# EAGLE design stuffMonitor (EAGLE 8.3.2)
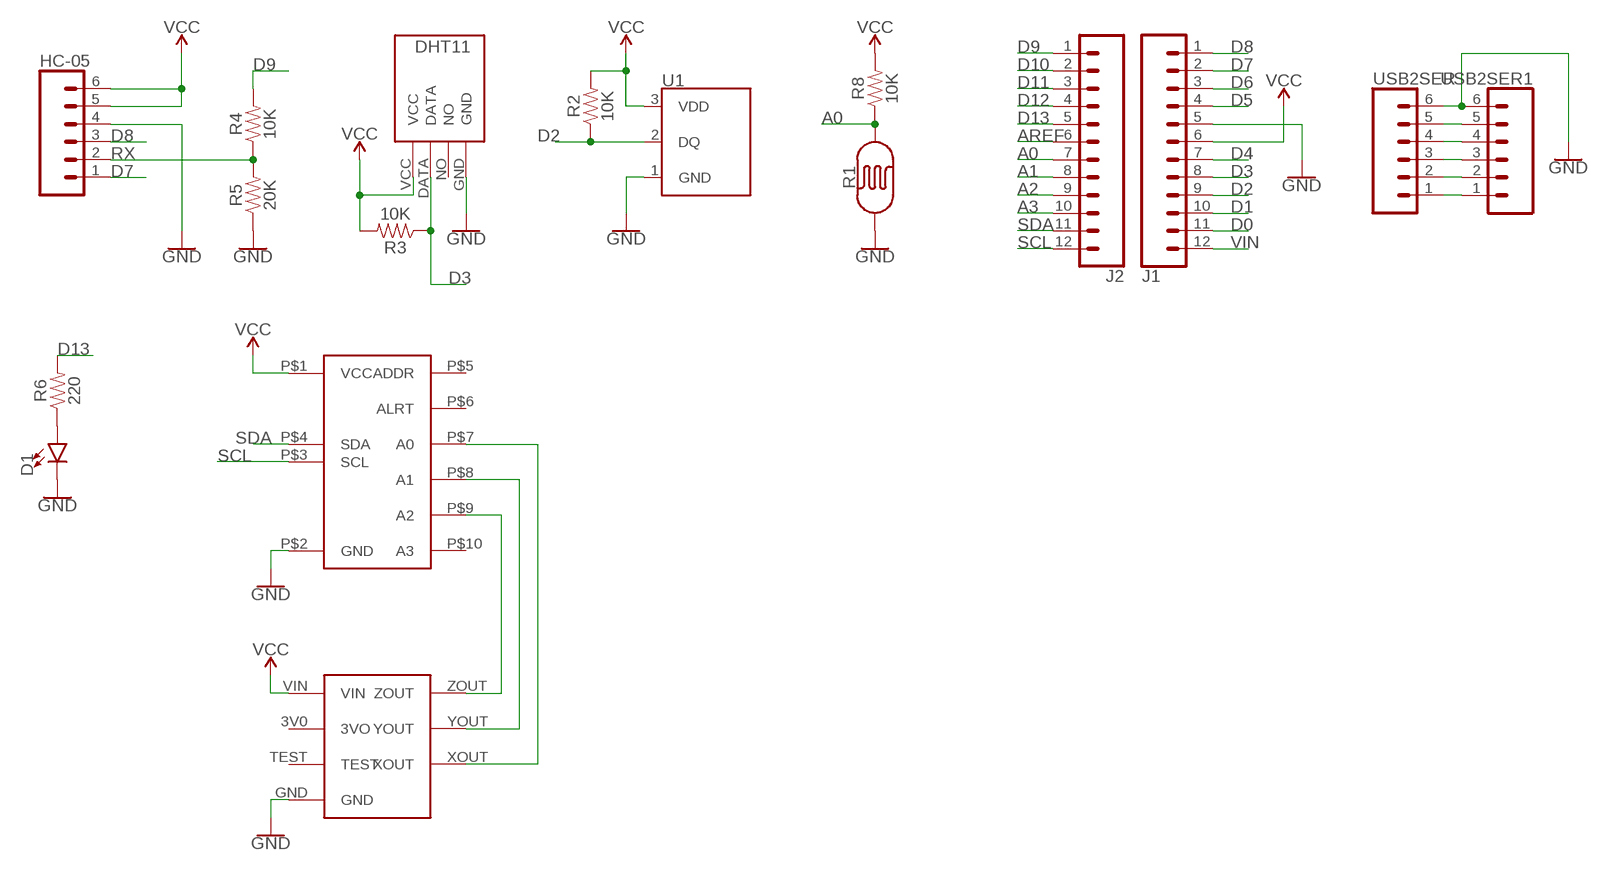
[diagram p0: schematic, sheet 1]

## Parts
D1  LED5MM  [LED_5MM]
HC-05  CONN_06NO_SILK_FEMALE_PTH  [1X06_NO_SILK]
J1  CONN_12  [1X12]
J2  CONN_12  [1X12]
R1  PHOTOCELLPTH  [PHOTOCELL]
R2  10K  1KOHM-VERT-1/4W-5%  [AXIAL-0.1]
R3  10K  1KOHM-VERT-1/4W-5%  [AXIAL-0.1]
R4  10K  1KOHM-VERT-1/4W-5%  [AXIAL-0.1]
R5  20K  1KOHM-VERT-1/4W-5%  [AXIAL-0.1]
R6  220  1KOHM-VERT-1/4W-5%  [AXIAL-0.1]
R8  10K  1KOHM-VERT-1/4W-5%  [AXIAL-0.1]
U1  DS18B20  [TO-92-AMMO]
U$2  SCRAPACCEL  [SCRAPACCELANALOG]
U$3  12BITADCADAFRUIT  [ADC12BITADAFRUIT]
U$4  DHT11-PION.  [DHT11-PION.]
USB2SER  CONN_06NO_SILK_FEMALE_PTH  [1X06_NO_SILK]
USB2SER1  CONN_06NO_SILK_FEMALE_PTH  [1X06_NO_SILK]

## Nets
A0: J2.7 R1.2 R8.P$1
A1: J2.8
A2: J2.9
A3: J2.10
AREF: J2.6
D0: J1.11
D1: J1.10
D2: J1.9 R2.P$1 U1.2(DQ)
D3: J1.8 R3.P$1 U$4.DATA
D4: J1.7
D5: J1.4
D6: J1.3
D7: HC-05.1 J1.2
D8: HC-05.3 J1.1
D9: J2.1 R4.P$2
D10: J2.2
D11: J2.3
D12: J2.4
D13: J2.5 R6.P$2
GND: D1.K(C) HC-05.4 J1.5 R1.1 R5.P$1 U1.1(GND) U$2.GND U$3.P$2(GND) U$4.GND USB2SER1.6 USB2SER.6
N$1: D1.A R6.P$1
N$2: USB2SER1.1 USB2SER.1
N$3: USB2SER1.2 USB2SER.2
N$4: USB2SER1.3 USB2SER.3
N$5: USB2SER1.4 USB2SER.4
N$6: USB2SER1.5 USB2SER.5
N$7: U$2.ZOUT U$3.P$9(A2)
N$8: U$2.YOUT U$3.P$8(A1)
N$9: U$2.XOUT U$3.P$7(A0)
RX: HC-05.2 R4.P$1 R5.P$2
SCL: J2.12 U$3.P$3(SCL)
SDA: J2.11 U$3.P$4(SDA)
VCC: HC-05.5 HC-05.6 J1.6 R2.P$2 R3.P$2 R8.P$2 U1.3(VDD) U$2.VIN U$3.P$1(VCC) U$4.VCC
VIN: J1.12
Unconnected: U$2.3V0(3VO) U$2.TEST U$3.P$5(ADDR) U$3.P$6(ALRT) U$3.P$10(A3) U$4.NO

## Library data of the parts
D1 = SparkFun-LED:LED: LED (Generic) Standard schematic elements and footprints for 5mm, 3mm, 1206, and 0603 sized LEDs. Generic LEDs with no color specified.
HC-05 USB2SER USB2SER1 = SparkFun-Connectors:CONN_06: Multi connection point. Often used as Generic Header-pin footprint for 0.1 inch spaced/style header connections On any of the 0.1 inch spaced packages, you can populate with these: Break Away Headers - Straight <https://www.sparkfun.com/products/116> (PRT-00116) Break Away Male Headers - Right Angle <https://www.sparkfun.com/products/553> (PRT-00553) Female Headers <https://www.sparkfun.com/products/115> (PRT-00115) Break Away Headers - Machine Pin <https://www.sparkfun.com/products/117> (PRT-00117) Break Away Female Headers - Swiss Machine Pin <https://www.sparkfun.com/products/743> (PRT-00743) Arduino Stackable Header - 6 Pin <https://www.sparkfun.com/products/9280> (PRT-09280) For SCREWTERMINALS and SPRING TERMINALS visit here: Screw Terimnals on SparkFun.com <https://www.sparkfun.com/search/results?term=Screw+Terminals> (5mm/3.5mm/2.54mm spacing) This device is also useful as a general connection point to wire up your design to another part of your project. Our various solder wires solder well into these plated through hole pads. Hook-Up Wire - Assortment (Stranded, 22 AWG) <https://www.sparkfun.com/products/11375> (PRT-11375) Hook-Up Wire - Assortment (Solid Core, 22 AWG) <https://www.sparkfun.com/products/11367> (PRT-11367) View the entire wire category on our website here <https://www.sparkfun.com/categories/141>; PROD_ID: CONN-08437
J1 J2 = SparkFun-Connectors:CONN_12: Multi connection point. Often used as Generic Header-pin footprint for 0.1 inch spaced/style header connections On any of the 0.1 inch spaced packages, you can populate with these: Break Away Headers - Straight <https://www.sparkfun.com/products/116> (PRT-00116) Break Away Male Headers - Right Angle <https://www.sparkfun.com/products/553> (PRT-00553) Female Headers <https://www.sparkfun.com/products/115> (PRT-00115) Break Away Headers - Machine Pin <https://www.sparkfun.com/products/117> (PRT-00117) Break Away Female Headers - Swiss Machine Pin <https://www.sparkfun.com/products/743> (PRT-00743) For SCREWTERMINALS and SPRING TERMINALS visit here: Screw Terimnals on SparkFun.com <https://www.sparkfun.com/search/results?term=Screw+Terminals> (5mm/3.5mm/2.54mm spacing) This device is also useful as a general connection point to wire up your design to another part of your project. Our various solder wires solder well into these plated through hole pads. Hook-Up Wire - Assortment (Stranded, 22 AWG) <https://www.sparkfun.com/products/11375> (PRT-11375) Hook-Up Wire - Assortment (Solid Core, 22 AWG) <https://www.sparkfun.com/products/11367> (PRT-11367) View the entire wire category on our website here <https://www.sparkfun.com/categories/141> Special notes: Molex polarized connector foot print use with SKU : PRT-08231 with associated crimp pins and housings. 1MM SMD Version SKU: PRT-10208 NOTES ON THE VARIANTS LOCK and LOCK_LONGPADS... This footprint was designed to help hold the alignment of a through-hole component (i.e. 6-pin header) while soldering it into place. You may notice that each hole has been shifted either up or down by 0.005 of an inch from it's more standard position (which is a perfectly straight line). This slight alteration caused the pins (the squares in the middle) to touch the edges of the holes. Because they are alternating, it causes a "brace" to hold the component in place. 0.005 has proven to be the perfect amount of "off-center" position when using our standard breakaway headers. Although looks a little odd when you look at the bare footprint, once you have a header in there, the alteration is very hard to notice. Also,if you push a header all the way into place, it is covered up entirely on the bottom side.
R1 = SparkFun-Sensors:PHOTOCELL: Photocell (Photodetector, Photo Resistor, CdS) This is a very small light sensor. A photocell changes (also called a photodetector, photo resistor, CdS or photoconductive cell) resistance depending on the amount of light it is exposed to. These little sensors make great ambient light triggers (when light in the room turns on, do something). Datasheet <http://cdn.sparkfun.com/datasheets/Sensors/LightImaging/SEN-09088.pdf> SparkFun Products Mini Photocell <https://www.sparkfun.com/products/9088> (SEN-09088); PROD_ID: COMP-09129; SF_ID: SEN-09088
R2-R6 R8 = SparkFun-Resistors:1KOHM: 1kΩ resistor A resistor is a passive two-terminal electrical component that implements electrical resistance as a circuit element. Resistors act to reduce current flow, and, at the same time, act to lower voltage levels within circuits. - Wikipedia; PROD_ID: RES-08380; VALUE: 1k
U1 = SparkFun-Sensors:DS18B20: Dallas/Maxim DS18B20 1-Wire Temperature Sensor The DS18B20 reports degrees C with 9 to 12-bit precision, -55C to 125C (+/-0.5C). Each sensor has a unique 64-Bit Serial number etched into it - allows for a huge number of sensors to be used on one data bus. Datasheet <http://datasheets.maximintegrated.com/en/ds/DS18B20.pdf> SparkFun Products One Wire Digital Temperature Sensor - DS18B20 <https://www.sparkfun.com/products/245> (SEN-00245); STORE_ID: SEN-00245
U$2 = scrapAccel:SCRAPACCEL
U$3 = 12bitadcadafruit:12BITADCADAFRUIT
U$4 = DHT11:DHT11-PION.: DHT11 Czujnik temperatury i wilgotności (widok pionowy)

## Board
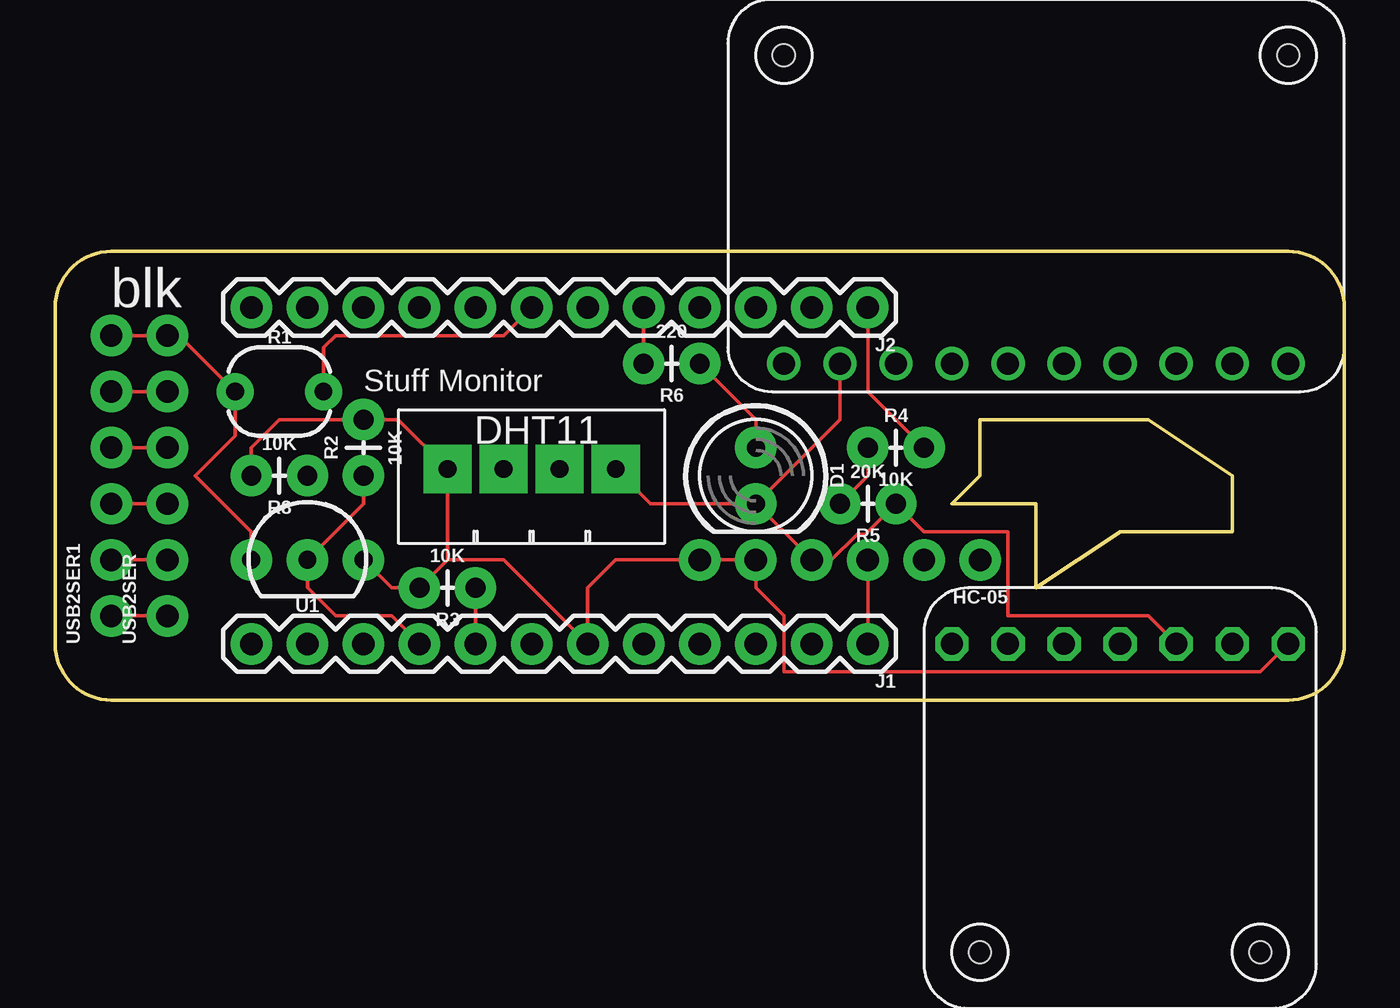
[diagram p1: board, top side]
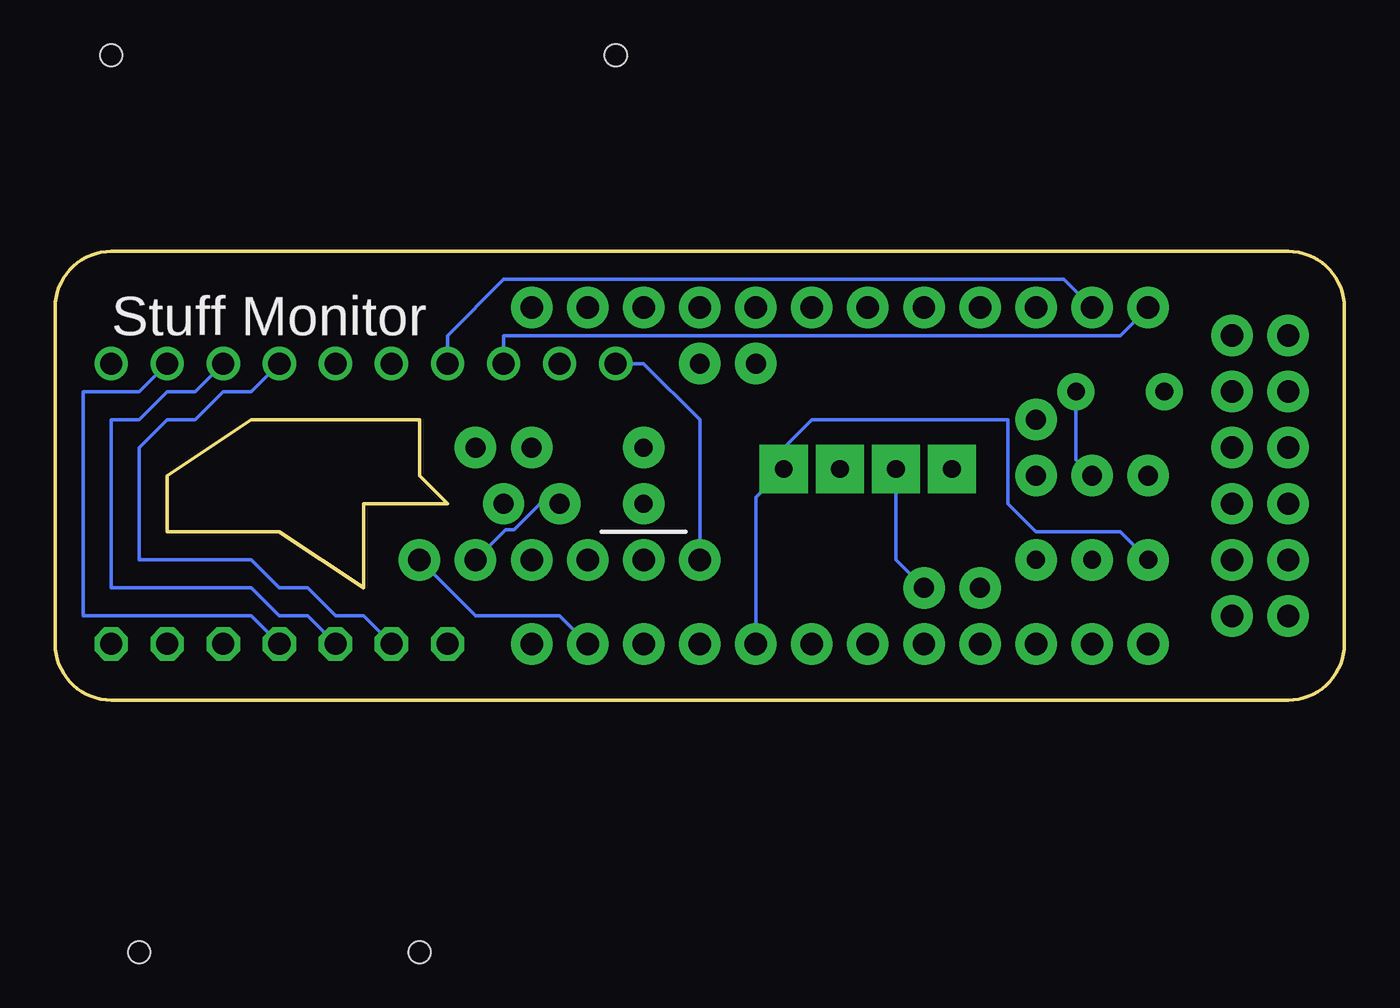
[diagram p2: board, bottom side, seen from below]

Size 58.42 x 20.32 mm. Coordinates in mm from the lower left corner, seen from the top.
Outline: 0,17.78 arc-90 2.54,20.32 55.88,20.32 arc-90 58.42,17.78 58.42,2.54 arc-90 55.88,0 2.54,0 arc-90 0,2.54 0,17.78
Outline: 44.45,8.89 40.64,8.89 41.91,10.16 41.91,12.7 49.53,12.7 53.34,10.16 53.34,7.62 48.26,7.62 44.45,5.08 44.45,8.89
Copper layers (1*16): Top 0.035mm / dielectric 1.5mm / Bottom 0.035mm
Design rules "default": minimum track width 6mil, minimum drill 0.35mm, track to track 6mil, track to pad 6mil, pad to pad 6mil, via to via 6mil, smd to smd 6mil, copper to edge 40mil, drill to drill 6mil, minimum pad ring 10mil, minimum via ring 8mil, stop-mask expansion 4mil, vias tented up to drill 0mil, thermal gap 10mil

### Footprints (pad centres in the part's own frame; a part is rotated, then mirrored left to right if it is on the bottom)
LED_5MM = drill 0.813 pad 1.88: A -1.27,0; K 1.27,0
1X06_NO_SILK = drill 1.016 pad 1.88: 1 0,0; 2 2.54,0; 3 5.08,0; 4 7.62,0; 5 10.16,0; 6 12.7,0
1X12 = drill 1.016 pad 1.88: 1 0,0; 2 2.54,0; 3 5.08,0; 4 7.62,0; 5 10.16,0; 6 12.7,0; 7 15.24,0; 8 17.78,0; 9 20.32,0; 10 22.86,0; 11 25.4,0; 12 27.94,0
PHOTOCELL = drill 0.8 pad 1.676: 1 -2,0; 2 2,0
AXIAL-0.1 = drill 0.9 pad 1.88: P$1 -1.27,0; P$2 1.27,0
TO-92-AMMO = drill 0.813 pad 1.88: 1 -2.54,0; 2 0,0; 3 2.54,0
SCRAPACCELANALOG = drill 1 octagon: 3V0 -5.08,-7.62; GND -2.54,-7.62; TEST 7.62,-7.62; VIN -7.62,-7.62; XOUT 5.08,-7.62; YOUT 2.54,-7.62; ZOUT 0,-7.62 | hole 1: -6.35,6.35; 6.35,6.35
ADC12BITADAFRUIT = drill 1: P$1 2.54,0; P$2 5.08,0; P$3 7.62,0; P$4 10.16,0; P$5 12.7,0; P$6 15.24,0; P$7 17.78,0; P$8 20.32,0; P$9 22.86,0; P$10 25.4,0 | hole 1: 2.54,13.97; 25.4,13.97
DHT11-PION. = drill 0.8 pad 2.184 square: DATA -1.27,0.305; GND 3.81,0.305; NO 1.27,0.305; VCC -3.81,0.305

### Placement (x,y rotation side)
D1  31.75,10.16 270 top
HC-05  41.91,6.35 180 top
J1  36.83,2.54 180 top
J2  36.83,17.78 180 top
R1  10.16,13.97 0 top
R2  13.97,11.43 90 top
R3  17.78,5.08 180 top
R4  38.1,11.43 0 top
R5  36.83,8.89 180 top
R6  27.94,15.24 180 top
R8  10.16,10.16 180 top
U1  11.43,6.35 0 top
U$2  48.26,-5.08 180 top
U$3  30.48,15.24 0 top
U$4  21.59,10.16 0 top
USB2SER  5.08,3.81 90 top
USB2SER1  2.54,3.81 90 top

### Tracks (layer width: path | path; a pad name or v marks a point on that pad's centre or on a via)
A0
  Top 0.152: R1.2 12.16,15.97 12.7,16.51 20.32,16.51 J2.7
  Bottom 0.152: R1.2 12.16,10.89 R8.P$1
D2
  Top 0.152: R2.P$1 13.97,8.89 U1.2 11.43,5.08 12.7,3.81 15.24,3.81 J1.9
D3
  Top 0.152: R3.P$1 J1.8
  Bottom 0.152: U$4.DATA 20.32,6.35 R3.P$1
D7
  Bottom 0.152: J1.2 35.56,3.81 39.37,3.81 HC-05.1
D8
  Top 0.152: HC-05.3 J1.1
D9
  Top 0.152: R4.P$2 36.83,13.97 J2.1
D13
  Top 0.152: R6.P$2 J2.5
GND
  Top 0.152: USB2SER1.6 USB2SER.6 5.62,16.51 R1.1 8.16,11.97 6.35,10.16 8.89,7.62 U1.1 | D1.K 26.97,8.89 U$4.GND | D1.K HC-05.4 35.18,6.35 36.35,7.52 36.73,7.52 R5.P$1 39.37,7.62 43.18,7.62 43.18,3.81 49.53,3.81 U$2.GND | U$3.P$2 35.56,12.7 D1.K
  Bottom 0.152: U1.1 10.16,7.62 13.97,7.62 15.24,8.89 15.24,12.7 24.13,12.7 25.4,11.43 U$4.GND 26.67,9.2 J1.5
N$1
  Top 0.152: D1.A 31.75,12.7 R6.P$1
N$2
  Top 0.152: USB2SER1.1 USB2SER.1
N$3
  Top 0.152: USB2SER1.2 USB2SER.2
N$4
  Top 0.152: USB2SER1.3 USB2SER.3
N$5
  Top 0.152: USB2SER1.4 USB2SER.4
N$6
  Top 0.152: USB2SER1.5 USB2SER.5
N$7
  Bottom 0.152: U$3.P$9 54.61,13.97 57.15,13.97 57.15,3.81 49.53,3.81 U$2.ZOUT
N$8
  Bottom 0.152: U$3.P$8 52.07,13.97 53.34,13.97 54.61,12.7 55.88,12.7 55.88,5.08 49.53,5.08 48.26,3.81 46.99,3.81 U$2.YOUT
N$9
  Bottom 0.152: U$3.P$7 49.53,13.97 50.8,13.97 52.07,12.7 53.34,12.7 54.61,11.43 54.61,6.35 49.53,6.35 48.26,5.08 46.99,5.08 45.72,3.81 44.45,3.81 U$2.XOUT
RX
  Top 0.152: R4.P$1 36.83,10.16 R5.P$2
  Bottom 0.152: HC-05.2 38,7.72 37.62,7.72 36.45,8.89 R5.P$2
SCL
  Bottom 0.152: U$3.P$3 38.1,16.51 10.16,16.51 J2.12
SDA
  Bottom 0.152: U$3.P$4 40.64,16.51 38.1,19.05 12.7,19.05 J2.11
VCC
  Top 0.152: R8.P$2 8.89,11.43 10.16,12.7 R2.P$2 15.55,12.7 U$4.VCC 17.78,6.35 | 17.78,6.35 R3.P$2 15.24,5.08 U1.3 | 17.78,6.35 20.32,6.35 J1.6 24.13,5.08 25.4,6.35 HC-05.6 HC-05.5 31.75,5.08 33.02,3.81 33.02,1.27 54.61,1.27 U$2.VIN
  Bottom 0.152: U$3.P$1 31.75,15.24 29.21,12.7 HC-05.6

### Text on the board
tPlace: blk | Stuff Monitor
bPlace: Stuff Monitor